# Altium schematic sheet SpaceVNXBaseBoard.SchDoc: SpaceVNXBaseBoard
size A4; Author: Carlos Barreiro; Organization: Escuela Técnica Superior de Ingeniería de Sistemas Informáticos de la Universidad Politécnica de Madrid; Address1: Campus Sur de la Universidad Politécnica de Madrid; Address2: Calle de Alan Turing, s/nº; Address3: Madrid 28031; Address4: España; DocumentNumber: 1; Revision: A; SheetNumber: 1; SheetTotal: 16
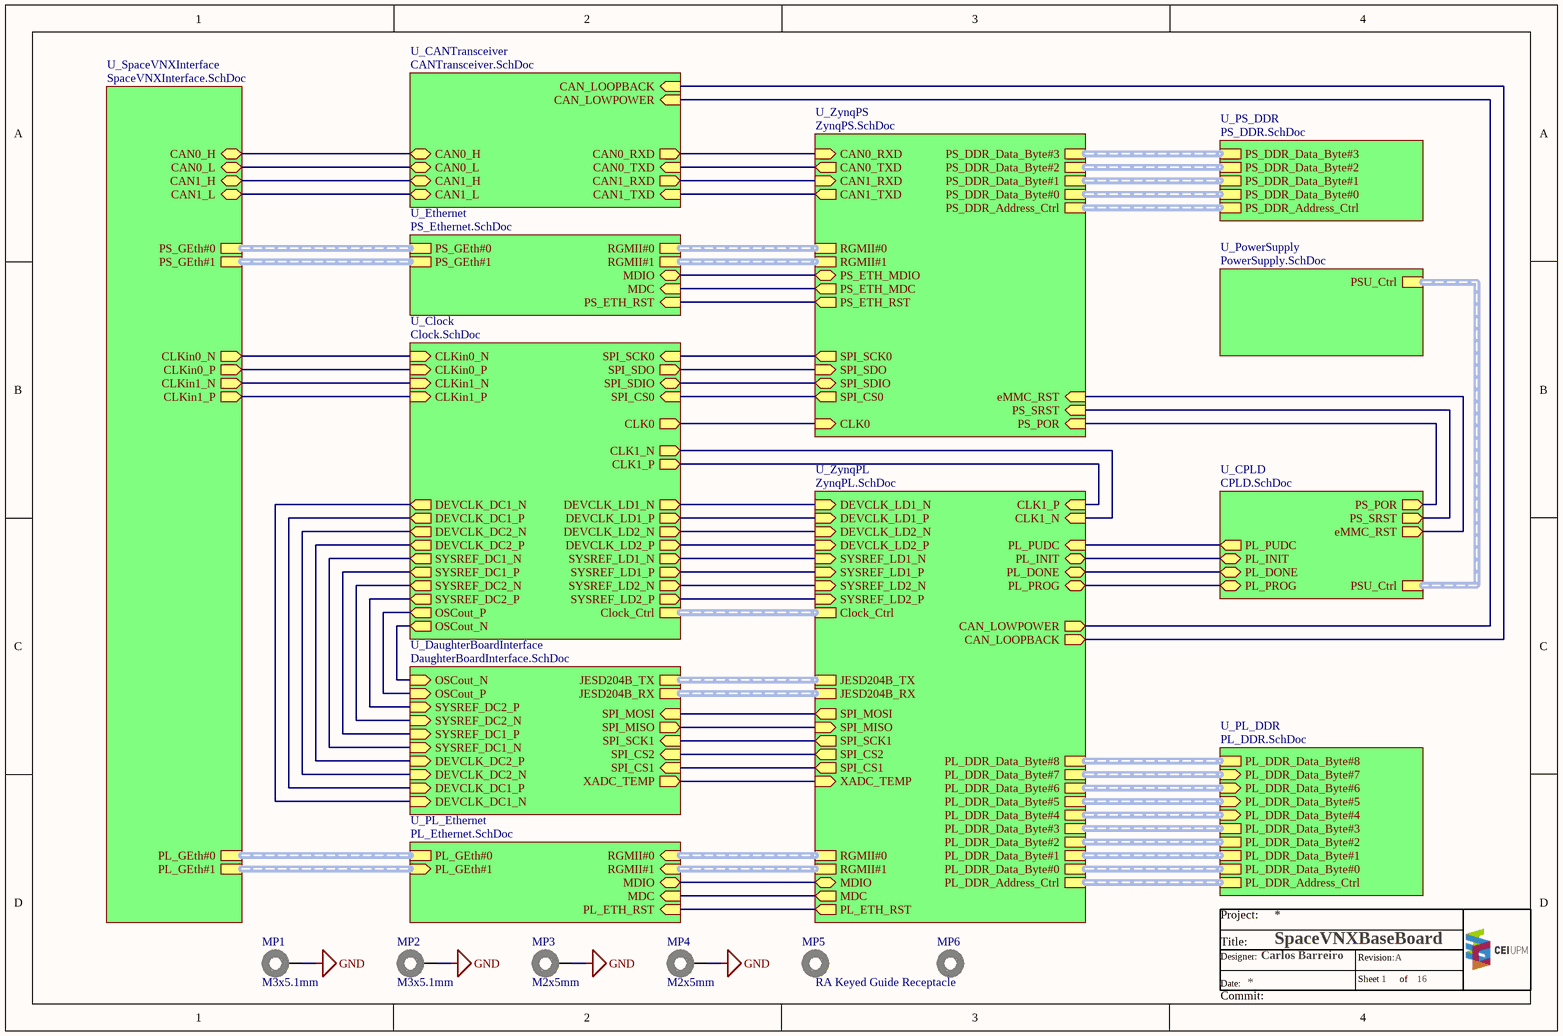
[diagram p0: SpaceVNXBaseBoard.SchDoc]

## Parts
MP1  M3x5.1mm  [9775051360]
MP2  M3x5.1mm  [9775051360]
MP3  M2x5mm  [9774050243]
MP4  M2x5mm  [9774050243]
MP5  RA Keyed Guide Receptacle  [Guide Pin Receptacle]
MP6  RA Keyed Guide Receptacle  [Guide Pin Receptacle]  (value not drawn)

## Sub-sheets
U_CANTransceiver = CANTransceiver.SchDoc: CAN0_RXD (out), CAN0_TXD (in), CAN1_RXD (out), CAN1_TXD (in), CAN0_L (bidir), CAN1_H (bidir), CAN0_H (bidir), CAN1_L (bidir), CAN_LOOPBACK (in), CAN_LOWPOWER (in)
U_Clock = Clock.SchDoc: CLK0 (out), CLK1_P (out), CLK1_N (out), Clock_Ctrl (harness Clock_Ctrl), CLKin1_N (in), CLKin1_P (in), CLKin0_N (in), CLKin0_P (in), DEVCLK_LD1_N (out), DEVCLK_LD2_P (out), DEVCLK_LD2_N (out), SYSREF_LD2_P (out), SYSREF_LD1_N (out), SYSREF_LD2_N (out), DEVCLK_LD1_P (out), SYSREF_LD1_P (out), SYSREF_DC1_P (out), SYSREF_DC2_N (out), DEVCLK_DC2_N (out), SYSREF_DC1_N (out), DEVCLK_DC1_P (out), DEVCLK_DC2_P (out), SYSREF_DC2_P (out), DEVCLK_DC1_N (out), SPI_SCK0 (in), SPI_SDO (out), SPI_SDIO (bidir), SPI_CS0 (in), OSCout_P (out), OSCout_N (out)
U_CPLD = CPLD.SchDoc: PL_PUDC (out), PS_SRST (out), PS_POR (out), PL_PROG (bidir), PL_INIT (bidir), PL_DONE (bidir), PSU_Ctrl (harness PSU_Ctrl), eMMC_RST (out)
U_DaughterBoardInterface = DaughterBoardInterface.SchDoc: JESD204B_TX (harness JESD204B), JESD204B_RX (harness JESD204B), SPI_MOSI (in), SPI_SCK1 (in), SPI_CS1 (in), SPI_CS2 (in), SPI_MISO (out), DEVCLK_DC1_N (in), DEVCLK_DC1_P (in), DEVCLK_DC2_N (in), DEVCLK_DC2_P (in), SYSREF_DC1_N (in), SYSREF_DC1_P (in), SYSREF_DC2_N (in), SYSREF_DC2_P (in), OSCout_N (in), OSCout_P (in), XADC_TEMP (out)
U_Ethernet = PS_Ethernet.SchDoc: MDC (in), MDIO (bidir), RGMII#0 (harness RGMII), RGMII#1 (harness RGMII), PS_GEth#0 (harness GEth), PS_GEth#1 (harness GEth), PS_ETH_RST (in)
U_PL_DDR = PL_DDR.SchDoc: PL_DDR_Address_Ctrl (harness DDR_Address_Ctrl), PL_DDR_Data_Byte#0 (harness DDR_Data_Byte), PL_DDR_Data_Byte#1 (harness DDR_Data_Byte), PL_DDR_Data_Byte#2 (harness DDR_Data_Byte), PL_DDR_Data_Byte#3 (harness DDR_Data_Byte), PL_DDR_Data_Byte#5 (in, harness DDR_Data_Byte), PL_DDR_Data_Byte#4 (in, harness DDR_Data_Byte), PL_DDR_Data_Byte#6 (in, harness DDR_Data_Byte), PL_DDR_Data_Byte#7 (in, harness DDR_Data_Byte), PL_DDR_Data_Byte#8 (harness DDR_Data_Byte)
U_PL_Ethernet = PL_Ethernet.SchDoc: PL_GEth#1 (in, harness GEth), PL_GEth#0 (harness GEth), MDC (in), MDIO (bidir), RGMII#0 (in, harness RGMII), RGMII#1 (in, harness RGMII), PL_ETH_RST (in)
U_PowerSupply = PowerSupply.SchDoc: PSU_Ctrl (harness PSU_Ctrl)
U_PS_DDR = PS_DDR.SchDoc: PS_DDR_Address_Ctrl (harness DDR_Address_Ctrl), PS_DDR_Data_Byte#0 (harness DDR_Data_Byte), PS_DDR_Data_Byte#1 (harness DDR_Data_Byte), PS_DDR_Data_Byte#2 (harness DDR_Data_Byte), PS_DDR_Data_Byte#3 (harness DDR_Data_Byte)
U_SpaceVNXInterface = SpaceVNXInterface.SchDoc: CLKin0_N (out), CLKin0_P (out), CLKin1_N (out), CLKin1_P (out), PS_GEth#0 (harness GEth), PS_GEth#1 (harness GEth), CAN0_H (bidir), CAN0_L (bidir), CAN1_H (bidir), CAN1_L (bidir), PL_GEth#0 (harness GEth), PL_GEth#1 (harness GEth)
U_ZynqPL = ZynqPL.SchDoc: PL_DDR_Data_Byte#7 (harness DDR_Data_Byte), PL_DDR_Data_Byte#6 (harness DDR_Data_Byte), PL_DDR_Data_Byte#5 (harness DDR_Data_Byte), PL_DDR_Data_Byte#4 (harness DDR_Data_Byte), PL_DDR_Data_Byte#3 (harness DDR_Data_Byte), PL_DDR_Data_Byte#2 (harness DDR_Data_Byte), PL_DDR_Data_Byte#1 (harness DDR_Data_Byte), PL_DDR_Data_Byte#0 (harness DDR_Data_Byte), PL_DDR_Address_Ctrl (harness DDR_Address_Ctrl), CLK1_P (in), CLK1_N (in), JESD204B_TX (harness JESD204B), JESD204B_RX (harness JESD204B), PL_DDR_Data_Byte#8 (harness DDR_Data_Byte), SPI_CS1 (out), SPI_CS2 (out), SPI_SCK1 (out), SPI_MISO (in), SPI_MOSI (out), Clock_Ctrl (harness Clock_Ctrl), DEVCLK_LD1_N (in), DEVCLK_LD1_P (in), DEVCLK_LD2_N (in), DEVCLK_LD2_P (in), SYSREF_LD1_N (in), SYSREF_LD1_P (in), SYSREF_LD2_N (in), SYSREF_LD2_P (in), PL_PUDC (in), PL_DONE (bidir), PL_INIT (bidir), PL_PROG (bidir), MDIO (bidir), MDC (out), PL_ETH_RST (out), RGMII#0 (harness RGMII), RGMII#1 (harness RGMII), XADC_TEMP (in), CAN_LOWPOWER (out), CAN_LOOPBACK (out)
U_ZynqPS = ZynqPS.SchDoc: PS_DDR_Data_Byte#0 (harness DDR_Data_Byte), PS_DDR_Data_Byte#2 (harness DDR_Data_Byte), PS_DDR_Address_Ctrl (harness DDR_Address_Ctrl), PS_DDR_Data_Byte#1 (harness DDR_Data_Byte), PS_DDR_Data_Byte#3 (harness DDR_Data_Byte), RGMII#1 (harness RGMII), PS_ETH_MDC (out), PS_ETH_MDIO (bidir), CLK0 (in), PS_POR (in), PS_SRST (in), RGMII#0 (harness RGMII), SPI_SCK0 (out), SPI_SDO (in), SPI_SDIO (bidir), SPI_CS0 (out), CAN1_RXD (in), CAN0_RXD (in), CAN1_TXD (out), CAN0_TXD (out), PS_ETH_RST (out), eMMC_RST (in)

## Nets
GND: MP1.1 MP2.1 MP3.1 MP4.1
(unnamed): sheet U_ZynqPS/PS_ETH_MDC, sheet U_Ethernet/MDC
(unnamed): sheet U_ZynqPS/PS_ETH_MDIO, sheet U_Ethernet/MDIO
(unnamed): sheet U_ZynqPS/CLK0, sheet U_Clock/CLK0
(unnamed): sheet U_ZynqPS/PS_POR, sheet U_CPLD/PS_POR
(unnamed): sheet U_ZynqPS/PS_SRST, sheet U_CPLD/PS_SRST
(unnamed): sheet U_ZynqPS/SPI_SCK0, sheet U_Clock/SPI_SCK0
(unnamed): sheet U_ZynqPS/SPI_SDO, sheet U_Clock/SPI_SDO
(unnamed): sheet U_ZynqPS/SPI_SDIO, sheet U_Clock/SPI_SDIO
(unnamed): sheet U_ZynqPS/SPI_CS0, sheet U_Clock/SPI_CS0
(unnamed): sheet U_ZynqPS/CAN1_RXD, sheet U_CANTransceiver/CAN1_RXD
(unnamed): sheet U_ZynqPS/CAN0_RXD, sheet U_CANTransceiver/CAN0_RXD
(unnamed): sheet U_ZynqPS/CAN1_TXD, sheet U_CANTransceiver/CAN1_TXD
(unnamed): sheet U_ZynqPS/CAN0_TXD, sheet U_CANTransceiver/CAN0_TXD
(unnamed): sheet U_ZynqPS/PS_ETH_RST, sheet U_Ethernet/PS_ETH_RST
(unnamed): sheet U_ZynqPS/eMMC_RST, sheet U_CPLD/eMMC_RST
(unnamed): sheet U_ZynqPL/CLK1_P, sheet U_Clock/CLK1_P
(unnamed): sheet U_ZynqPL/CLK1_N, sheet U_Clock/CLK1_N
(unnamed): sheet U_ZynqPL/SPI_CS1, sheet U_DaughterBoardInterface/SPI_CS1
(unnamed): sheet U_ZynqPL/SPI_CS2, sheet U_DaughterBoardInterface/SPI_CS2
(unnamed): sheet U_ZynqPL/SPI_SCK1, sheet U_DaughterBoardInterface/SPI_SCK1
(unnamed): sheet U_ZynqPL/SPI_MISO, sheet U_DaughterBoardInterface/SPI_MISO
(unnamed): sheet U_ZynqPL/SPI_MOSI, sheet U_DaughterBoardInterface/SPI_MOSI
(unnamed): sheet U_ZynqPL/DEVCLK_LD1_N, sheet U_Clock/DEVCLK_LD1_N
(unnamed): sheet U_ZynqPL/DEVCLK_LD1_P, sheet U_Clock/DEVCLK_LD1_P
(unnamed): sheet U_ZynqPL/DEVCLK_LD2_N, sheet U_Clock/DEVCLK_LD2_N
(unnamed): sheet U_ZynqPL/DEVCLK_LD2_P, sheet U_Clock/DEVCLK_LD2_P
(unnamed): sheet U_ZynqPL/SYSREF_LD1_N, sheet U_Clock/SYSREF_LD1_N
(unnamed): sheet U_ZynqPL/SYSREF_LD1_P, sheet U_Clock/SYSREF_LD1_P
(unnamed): sheet U_ZynqPL/SYSREF_LD2_N, sheet U_Clock/SYSREF_LD2_N
(unnamed): sheet U_ZynqPL/SYSREF_LD2_P, sheet U_Clock/SYSREF_LD2_P
(unnamed): sheet U_ZynqPL/PL_PUDC, sheet U_CPLD/PL_PUDC
(unnamed): sheet U_ZynqPL/PL_DONE, sheet U_CPLD/PL_DONE
(unnamed): sheet U_ZynqPL/PL_INIT, sheet U_CPLD/PL_INIT
(unnamed): sheet U_ZynqPL/PL_PROG, sheet U_CPLD/PL_PROG
(unnamed): sheet U_ZynqPL/MDIO, sheet U_PL_Ethernet/MDIO
(unnamed): sheet U_ZynqPL/MDC, sheet U_PL_Ethernet/MDC
(unnamed): sheet U_ZynqPL/PL_ETH_RST, sheet U_PL_Ethernet/PL_ETH_RST
(unnamed): sheet U_ZynqPL/XADC_TEMP, sheet U_DaughterBoardInterface/XADC_TEMP
(unnamed): sheet U_ZynqPL/CAN_LOWPOWER, sheet U_CANTransceiver/CAN_LOWPOWER
(unnamed): sheet U_ZynqPL/CAN_LOOPBACK, sheet U_CANTransceiver/CAN_LOOPBACK
(unnamed): sheet U_DaughterBoardInterface/DEVCLK_DC1_N, sheet U_Clock/DEVCLK_DC1_N
(unnamed): sheet U_DaughterBoardInterface/DEVCLK_DC1_P, sheet U_Clock/DEVCLK_DC1_P
(unnamed): sheet U_DaughterBoardInterface/DEVCLK_DC2_N, sheet U_Clock/DEVCLK_DC2_N
(unnamed): sheet U_DaughterBoardInterface/DEVCLK_DC2_P, sheet U_Clock/DEVCLK_DC2_P
(unnamed): sheet U_DaughterBoardInterface/SYSREF_DC1_N, sheet U_Clock/SYSREF_DC1_N
(unnamed): sheet U_DaughterBoardInterface/SYSREF_DC1_P, sheet U_Clock/SYSREF_DC1_P
(unnamed): sheet U_DaughterBoardInterface/SYSREF_DC2_N, sheet U_Clock/SYSREF_DC2_N
(unnamed): sheet U_DaughterBoardInterface/SYSREF_DC2_P, sheet U_Clock/SYSREF_DC2_P
(unnamed): sheet U_DaughterBoardInterface/OSCout_N, sheet U_Clock/OSCout_N
(unnamed): sheet U_DaughterBoardInterface/OSCout_P, sheet U_Clock/OSCout_P
(unnamed): sheet U_Clock/CLKin1_N, sheet U_SpaceVNXInterface/CLKin1_N
(unnamed): sheet U_Clock/CLKin1_P, sheet U_SpaceVNXInterface/CLKin1_P
(unnamed): sheet U_Clock/CLKin0_N, sheet U_SpaceVNXInterface/CLKin0_N
(unnamed): sheet U_Clock/CLKin0_P, sheet U_SpaceVNXInterface/CLKin0_P
(unnamed): sheet U_SpaceVNXInterface/CAN0_H, sheet U_CANTransceiver/CAN0_H
(unnamed): sheet U_SpaceVNXInterface/CAN0_L, sheet U_CANTransceiver/CAN0_L
(unnamed): sheet U_SpaceVNXInterface/CAN1_H, sheet U_CANTransceiver/CAN1_H
(unnamed): sheet U_SpaceVNXInterface/CAN1_L, sheet U_CANTransceiver/CAN1_L

## Buses and harness runs
harness sheet U_Clock/Clock_Ctrl = sheet U_ZynqPL/Clock_Ctrl
harness sheet U_CPLD/PSU_Ctrl = sheet U_PowerSupply/PSU_Ctrl
harness sheet U_DaughterBoardInterface/JESD204B_RX = sheet U_ZynqPL/JESD204B_RX
harness sheet U_DaughterBoardInterface/JESD204B_TX = sheet U_ZynqPL/JESD204B_TX
harness sheet U_Ethernet/PS_GEth#0 = sheet U_SpaceVNXInterface/PS_GEth#0
harness sheet U_Ethernet/PS_GEth#1 = sheet U_SpaceVNXInterface/PS_GEth#1
harness sheet U_Ethernet/RGMII#0 = sheet U_ZynqPS/RGMII#0
harness sheet U_Ethernet/RGMII#1 = sheet U_ZynqPS/RGMII#1
harness sheet U_PL_DDR/PL_DDR_Address_Ctrl = sheet U_ZynqPL/PL_DDR_Address_Ctrl
harness sheet U_PL_DDR/PL_DDR_Data_Byte#0 = sheet U_ZynqPL/PL_DDR_Data_Byte#0
harness sheet U_PL_DDR/PL_DDR_Data_Byte#1 = sheet U_ZynqPL/PL_DDR_Data_Byte#1
harness sheet U_PL_DDR/PL_DDR_Data_Byte#2 = sheet U_ZynqPL/PL_DDR_Data_Byte#2
harness sheet U_PL_DDR/PL_DDR_Data_Byte#3 = sheet U_ZynqPL/PL_DDR_Data_Byte#3
harness sheet U_PL_DDR/PL_DDR_Data_Byte#4 = sheet U_ZynqPL/PL_DDR_Data_Byte#4
harness sheet U_PL_DDR/PL_DDR_Data_Byte#5 = sheet U_ZynqPL/PL_DDR_Data_Byte#5
harness sheet U_PL_DDR/PL_DDR_Data_Byte#6 = sheet U_ZynqPL/PL_DDR_Data_Byte#6
harness sheet U_PL_DDR/PL_DDR_Data_Byte#7 = sheet U_ZynqPL/PL_DDR_Data_Byte#7
harness sheet U_PL_DDR/PL_DDR_Data_Byte#8 = sheet U_ZynqPL/PL_DDR_Data_Byte#8
harness sheet U_PL_Ethernet/PL_GEth#0 = sheet U_SpaceVNXInterface/PL_GEth#0
harness sheet U_PL_Ethernet/PL_GEth#1 = sheet U_SpaceVNXInterface/PL_GEth#1
harness sheet U_PL_Ethernet/RGMII#0 = sheet U_ZynqPL/RGMII#0
harness sheet U_PL_Ethernet/RGMII#1 = sheet U_ZynqPL/RGMII#1
harness sheet U_PS_DDR/PS_DDR_Address_Ctrl = sheet U_ZynqPS/PS_DDR_Address_Ctrl
harness sheet U_PS_DDR/PS_DDR_Data_Byte#0 = sheet U_ZynqPS/PS_DDR_Data_Byte#0
harness sheet U_PS_DDR/PS_DDR_Data_Byte#1 = sheet U_ZynqPS/PS_DDR_Data_Byte#1
harness sheet U_PS_DDR/PS_DDR_Data_Byte#2 = sheet U_ZynqPS/PS_DDR_Data_Byte#2
harness sheet U_PS_DDR/PS_DDR_Data_Byte#3 = sheet U_ZynqPS/PS_DDR_Data_Byte#3

## Notes on the sheet
- Project:
- Title:
- Date:
- Designer:
- Sheet
- Revision:
- of
- Commit:

## Library data of the parts
MP1 MP2 = 9775051360: WA-SMSR SMT Steel Spacer Reverse with internal Thread M3, Length 5.1mm; Manufacturer: Wurth Elektronik; Inner Diameter: 4.2mm; Outer Diameter: 6mm; Surface: Tin; ComponentLink1Description: Manufacturer; ComponentLink1URL: http://www.we-online.de; ComponentLink2Description: Datasheet; ComponentLink2URL: https://www.we-online.com/catalog/datasheet/9775051360.pdf; Operating Temperature: -55 to +150degC; Manufacturer Part Number: 9775051360; Pin Length: 5.1mm; Hole Diameter: -; Material: Steel; Packaging: Bulk; Published Date: March 2021; Mounting Technology: SMT; Thread: M3
MP3 MP4 = 9774050243: WA-SMSI SMT Steel Spacer, internal Thread, OD 4.35mm, M2x5mm; Manufacturer: Wurth Elektronik; Inner Diameter: 2.8mm; Surface: Tin; Thread: M2; ComponentLink1Description: Manufacturer; ComponentLink1URL: http://www.we-online.de; ComponentLink2Description: Datasheet; ComponentLink2URL: https://www.we-online.com/catalog/datasheet/9774050243.pdf; Mounting Technology: SMT; Packaging: Bulk; Manufacturer Part Number: 9774050243; Length: 5mm; Inner Thread Length: -; Operating Temperature: -55 to +150degC; Outer Diameter: 4.35mm; Published Date: April 2020; Material: Steel
MP5 MP6 = Vita74_Guide_Post: Backplane Guide Hardware; ComponentLink1Description: Source; ComponentLink1URL: https://www.vita.com/VNX-Reference-Design